# EAGLE schematic LESR_MainBoard (EAGLE 9.5.2)

## Sheet 1 of 2
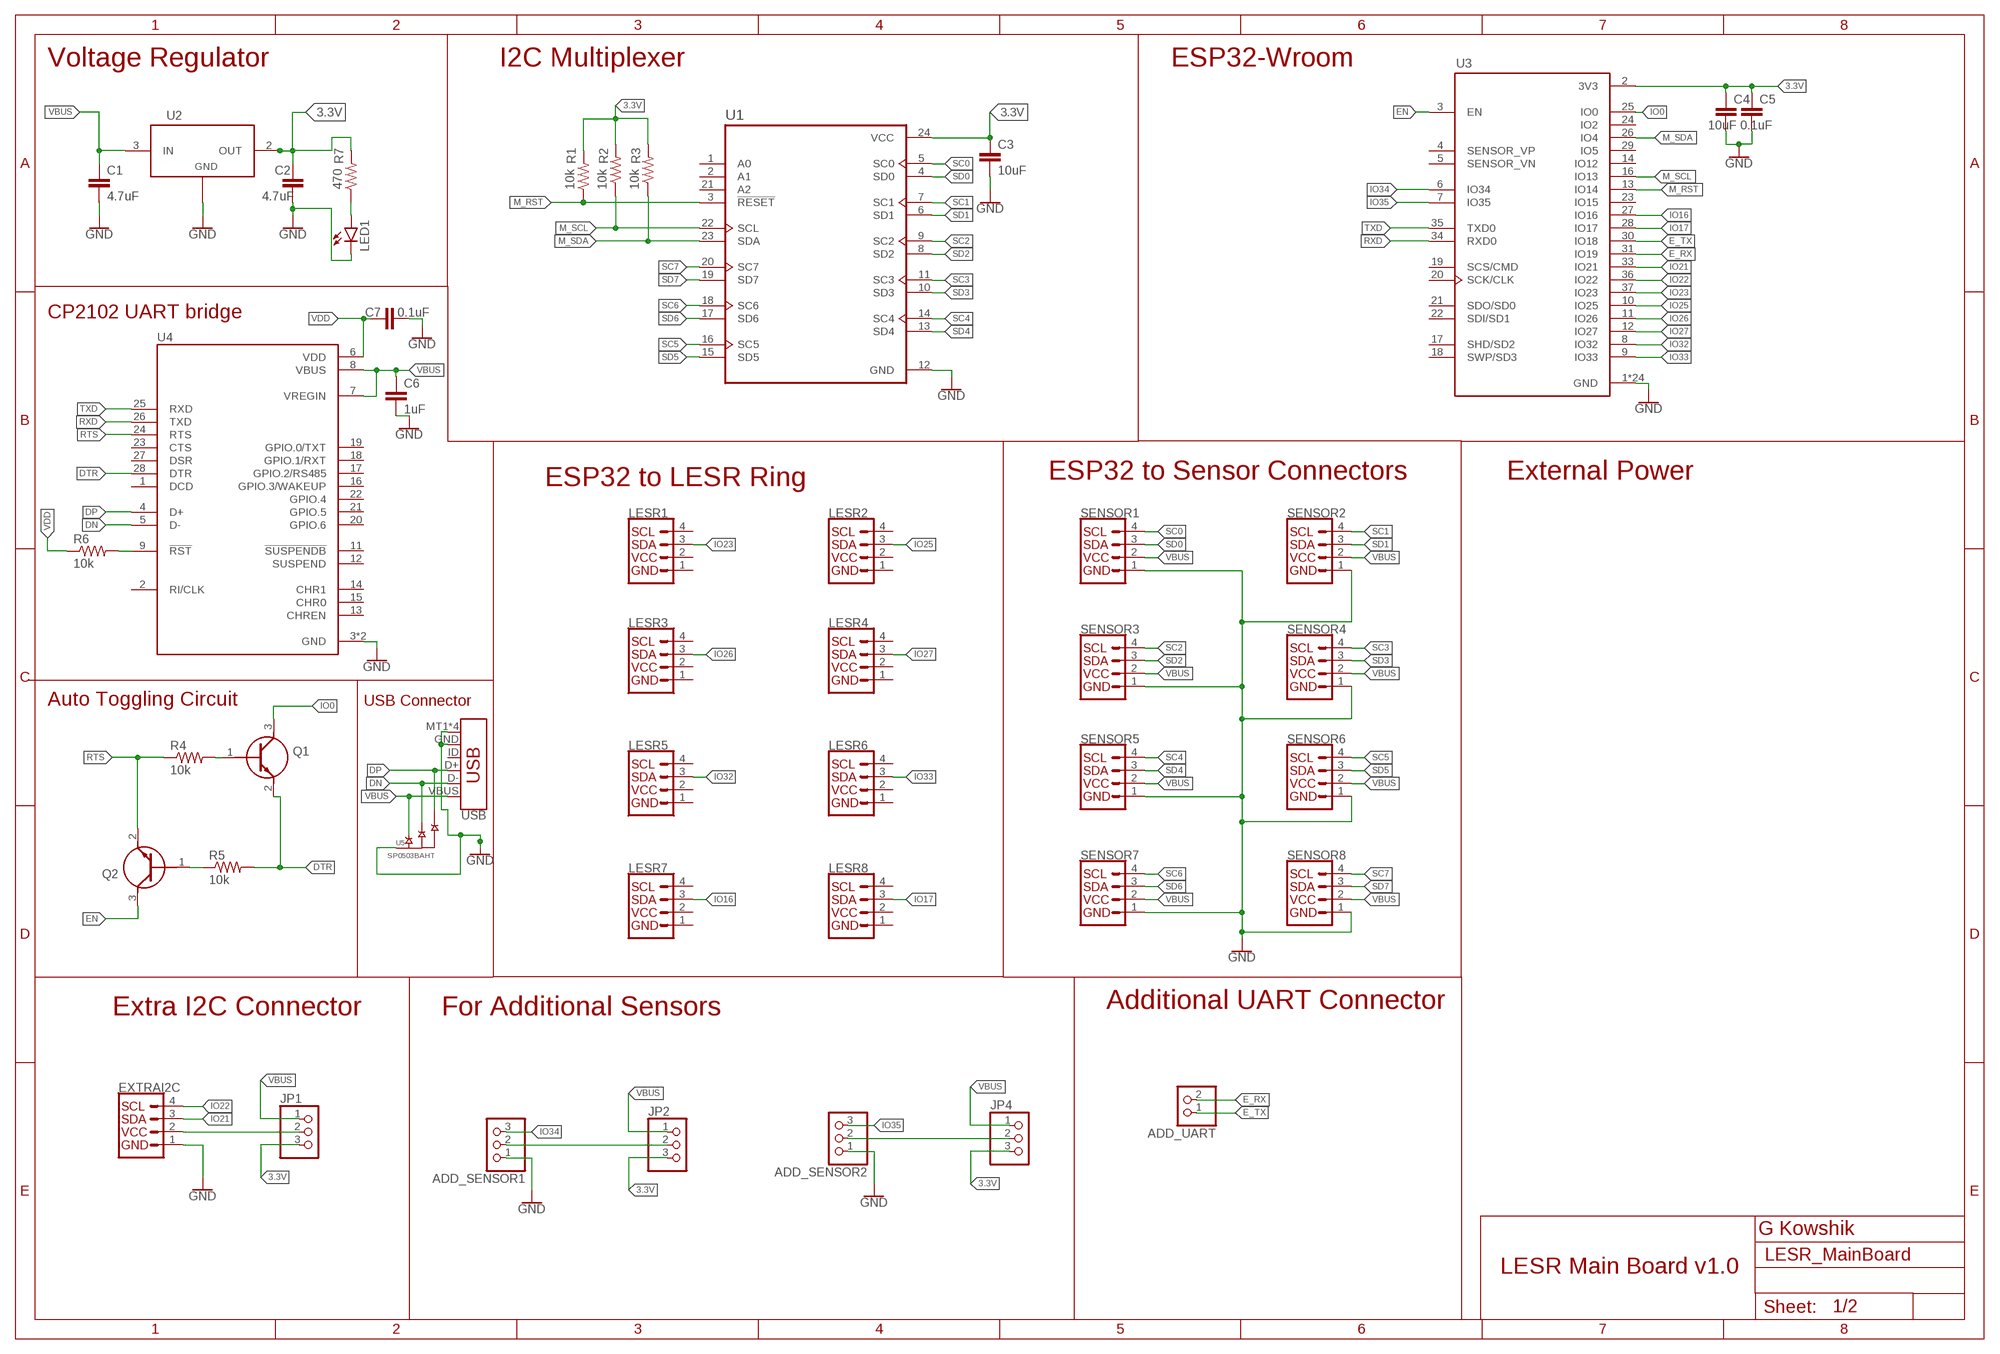
[diagram p0: schematic, sheet 1]

### Parts
ADD_SENSOR1  PINHD-1X3  [1X03]
ADD_SENSOR2  PINHD-1X3  [1X03]
ADD_UART  PINHD-1X2  [1X02]
C1  4.7uF  C-EUC0805  [C0805]
C2  4.7uF  C-EUC0805  [C0805]
C3  10uF  C-EUC0805  [C0805]
C4  10uF  C-EUC0805  [C0805]
C5  0.1uF  C-EUC0805  [C0805]
C6  1uF  C-EUC0805  [C0805]
C7  0.1uF  C-EUC0805  [C0805]
EXTRAI2C  Vertical Qwiic Connector  QWIIC_CONNECTOR  [JST04_1MM_VERT]
JP1  PINHD-1X3  [1X03]
JP2  PINHD-1X3  [1X03]
JP4  PINHD-1X3  [1X03]
LED1  LEDCHIPLED_0805  [CHIPLED_0805]
LESR1  Vertical Qwiic Connector  QWIIC_CONNECTOR  [JST04_1MM_VERT]
LESR2  Vertical Qwiic Connector  QWIIC_CONNECTOR  [JST04_1MM_VERT]
LESR3  Vertical Qwiic Connector  QWIIC_CONNECTOR  [JST04_1MM_VERT]
LESR4  Vertical Qwiic Connector  QWIIC_CONNECTOR  [JST04_1MM_VERT]
LESR5  Vertical Qwiic Connector  QWIIC_CONNECTOR  [JST04_1MM_VERT]
LESR6  Vertical Qwiic Connector  QWIIC_CONNECTOR  [JST04_1MM_VERT]
LESR7  Vertical Qwiic Connector  QWIIC_CONNECTOR  [JST04_1MM_VERT]
LESR8  Vertical Qwiic Connector  QWIIC_CONNECTOR  [JST04_1MM_VERT]
Q1  SS8050-G  [SOT95P240X115-3N]
Q2  SS8050-G  [SOT95P240X115-3N]
R1  10k  R-US_R0805  [R0805]
R2  10k  R-US_R0805  [R0805]
R3  10k  R-US_R0805  [R0805]
R4  10k  R-US_R0805  [R0805]
R5  10k  R-US_R0805  [R0805]
R6  10k  R-US_R0805  [R0805]
R7  470  R-US_R0805  [R0805]
SENSOR1  Vertical Qwiic Connector  QWIIC_CONNECTOR  [JST04_1MM_VERT]
SENSOR2  Vertical Qwiic Connector  QWIIC_CONNECTOR  [JST04_1MM_VERT]
SENSOR3  Vertical Qwiic Connector  QWIIC_CONNECTOR  [JST04_1MM_VERT]
SENSOR4  Vertical Qwiic Connector  QWIIC_CONNECTOR  [JST04_1MM_VERT]
SENSOR5  Vertical Qwiic Connector  QWIIC_CONNECTOR  [JST04_1MM_VERT]
SENSOR6  Vertical Qwiic Connector  QWIIC_CONNECTOR  [JST04_1MM_VERT]
SENSOR7  Vertical Qwiic Connector  QWIIC_CONNECTOR  [JST04_1MM_VERT]
SENSOR8  Vertical Qwiic Connector  QWIIC_CONNECTOR  [JST04_1MM_VERT]
U1  TCA9548APWR  [SOP65P640X120-24N]
U2  NCP1117ST33T3G  [SOT-223]
U3  ESP32-WROOM-32  [MODULE_ESP32-WROOM-32]
U4  CP2102N-A01-GQFN28  [QFN50P500X500X80-29N]
U5  SP0503BAHT  [SOT143]
USB  USB_MICRO-B_SMT  [USB-MICROB]

### Nets
3.3V: C2.1 C3.1 C4.1 C5.1 JP1.3 JP2.3 JP4.3 R1.2 R2.2 R3.2 R7.2 U1.24(VCC) U2.2(OUT) U2.4 U3.2(3V3)
DN: U4.5(D-) U5.3(B) USB.D-
DP: U4.4(D+) U5.4(C) USB.D+
DTR: Q1.2(E) R5.2 U4.28(DTR)
E_RX: ADD_UART.2 U3.31(IO19)
E_TX: ADD_UART.1 U3.30(IO18)
EN: Q2.3(C) U3.3(EN)
GND: ADD_SENSOR1.1 ADD_SENSOR2.1 C1.2 C2.2 C3.2 C4.2 C5.2 C6.2 C7.2 EXTRAI2C.1 LED1.C SENSOR1.1 SENSOR2.1 SENSOR3.1 SENSOR4.1 SENSOR5.1 SENSOR6.1 SENSOR7.1 SENSOR8.1 U1.12(GND) U2.1(ADJ/GND) U3.1(GND) U3.15(GND) U3.38(GND) U3.39_1(GND) U3.39_2(GND) U3.39_3(GND) U3.39_4(GND) U3.39_5(GND) U3.39_6(GND) U3.39_7(GND) U3.39_8(GND) U3.39_9(GND) U3.39_10(GND) U3.39_11(GND) U3.39_12(GND) U3.39_13(GND) U3.39_14(GND) U3.39_15(GND) U3.39_16(GND) U3.39_17(GND) U3.39_18(GND) U3.39_19(GND) U3.39_20(GND) U3.39_21(GND) U4.3(GND) U4.29(GND) U5.1(GND) USB.GND USB.MT1(SHIELD) USB.MT2(SHIELD) USB.P$1(SHIELD) USB.P$2(SHIELD)
IO0: Q1.3(C) U3.25(IO0)
IO16: LESR7.3 U3.27(IO16)
IO17: LESR8.3 U3.28(IO17)
IO21: EXTRAI2C.3 U3.33(IO21)
IO22: EXTRAI2C.4 U3.36(IO22)
IO23: LESR1.3 U3.37(IO23)
IO25: LESR2.3 U3.10(IO25)
IO26: LESR3.3 U3.11(IO26)
IO27: LESR4.3 U3.12(IO27)
IO32: LESR5.3 U3.8(IO32)
IO33: LESR6.3 U3.9(IO33)
IO34: ADD_SENSOR1.3 U3.6(IO34)
IO35: ADD_SENSOR2.3 U3.7(IO35)
M_RST: R1.1 U1.3(!RESET) U3.13(IO14)
M_SCL: R2.1 U1.22(SCL) U3.16(IO13)
M_SDA: R3.1 U1.23(SDA) U3.26(IO4)
N$1: ADD_SENSOR1.2 JP2.2
N$3: Q1.1(B) R4.2
N$4: Q2.1(B) R5.1
N$5: ADD_SENSOR2.2 JP4.2
N$6: R6.2 U4.9(!RST)
N$7: EXTRAI2C.2 JP1.2
N$8: LED1.A R7.1
RTS: Q2.2(E) R4.1 U4.24(RTS)
RXD: U3.34(RXD0) U4.26(TXD)
SC0: SENSOR1.4 U1.5(SC0)
SC1: SENSOR2.4 U1.7(SC1)
SC2: SENSOR3.4 U1.9(SC2)
SC3: SENSOR4.4 U1.11(SC3)
SC4: SENSOR5.4 U1.14(SC4)
SC5: SENSOR6.4 U1.16(SC5)
SC6: SENSOR7.4 U1.18(SC6)
SC7: SENSOR8.4 U1.20(SC7)
SD0: SENSOR1.3 U1.4(SD0)
SD1: SENSOR2.3 U1.6(SD1)
SD2: SENSOR3.3 U1.8(SD2)
SD3: SENSOR4.3 U1.10(SD3)
SD4: SENSOR5.3 U1.13(SD4)
SD5: SENSOR6.3 U1.15(SD5)
SD6: SENSOR7.3 U1.17(SD6)
SD7: SENSOR8.3 U1.19(SD7)
TXD: U3.35(TXD0) U4.25(RXD)
VBUS: C1.1 C6.1 JP1.1 JP2.1 JP4.1 SENSOR1.2 SENSOR2.2 SENSOR3.2 SENSOR4.2 SENSOR5.2 SENSOR6.2 SENSOR7.2 SENSOR8.2 U2.3(IN) U4.7(VREGIN) U4.8(VBUS) U5.2(A) USB.VBUS
VDD: C7.1 R6.1 U4.6(VDD)
Unconnected: LESR1.4 LESR2.4 LESR3.4 LESR4.4 LESR5.4 LESR6.4 LESR7.4 LESR8.4 U1.1(A0) U1.2(A1) U1.21(A2) U3.4(SENSOR_VP) U3.5(SENSOR_VN) U3.14(IO12) U3.17(SHD/SD2) U3.18(SWP/SD3) U3.19(SCS/CMD) U3.20(SCK/CLK) U3.21(SDO/SD0) U3.22(SDI/SD1) U3.23(IO15) U3.24(IO2) U3.29(IO5) U4.1(DCD) U4.2(RI/CLK) U4.11(!SUSPENDB) U4.12(SUSPEND) U4.13(CHREN) U4.14(CHR1) U4.15(CHR0) U4.16(GPIO.3/WAKEUP) U4.17(GPIO.2/RS485) U4.18(GPIO.1/RXT) U4.19(GPIO.0/TXT) U4.20(GPIO.6) U4.21(GPIO.5) U4.22(GPIO.4) U4.23(CTS) U4.27(DSR) USB.ID

### Notes on the sheet
- Voltage Regulator | I2C Multiplexer | ESP32-Wroom
- CP2102 UART bridge
- ESP32 to LESR Ring | ESP32 to Sensor Connectors | External Power
- Auto Toggling Circuit | USB Connector
- Extra I2C Connector | For Additional Sensors | Additional UART Connector
- G Kowshik
- LESR Main Board v1.0

## Sheet 2 of 2

## Power pins joined to a net without a drawn wire
1: LESR1.1 LESR2.1 LESR3.1 LESR4.1 LESR5.1 LESR6.1 LESR7.1 LESR8.1
2: LESR1.2 LESR2.2 LESR3.2 LESR4.2 LESR5.2 LESR6.2 LESR7.2 LESR8.2

## Library data of the parts
ADD_SENSOR1 ADD_SENSOR2 JP1 JP2 JP4 = adafruit:PINHD-1X3: PIN HEADER
ADD_UART = pinhead:PINHD-1X2: PIN HEADER
C1-C7 = rcl:C-EU: CAPACITOR, European symbol; SPICEPREFIX: C
EXTRAI2C LESR1-LESR8 SENSOR1-SENSOR8 = SparkFun-Connectors:QWIIC_CONNECTOR: SparkFun I2C Standard Qwiic Connector An SMD 1mm pitch JST connector makes it easy and quick (get it? Qwiic?) to connect I2C devices to each other. The Qwiic system <http://www.sparkfun.com/qwiic> enables fast and solderless connection between popular platforms and various sensors and actuators. We carry 200mm <https://www.sparkfun.com/products/14204>, 100mm <https://www.sparkfun.com/products/14205>, 50mm <https://www.sparkfun.com/products/14206>, and breadboard friendly <https://www.sparkfun.com/products/14207> Qwiic cables. We also offer 10 pcs strips <https://www.sparkfun.com/products/14323> the SMD connectors.; PROD_ID: CONN-14483
LED1 = led:LED: LED OSRAM: - CHIPLED LG R971, LG N971, LY N971, LG Q971, LY Q971, LO R971, LY R971 LH N974, LH R974 LS Q976, LO Q976, LY Q976 LO Q996 - Hyper CHIPLED LW Q18S LB Q993, LB Q99A, LB R99A - SideLED LS A670, LO A670, LY A670, LG A670, LP A670 LB A673, LV A673, LT A673, LW A673 LH A674 LY A675 LS A676, LA A676, LO A676, LY A676, LW A676 LS A679, LY A679, LG A679 - Hyper Micro SIDELED® LS Y876, LA Y876, LO Y876, LY Y876 LT Y87S - SmartLED LW L88C, LW L88S LB L89C, LB L89S, LG L890 LS L89K, LO L89K, LY L89K LS L896, LA L896, LO L896, LY L896 - TOPLED LS T670, LO T670, LY T670, LG T670, LP T670 LSG T670, LSP T670, LSY T670, LOP T670, LYG T670 LG T671, LOG T671, LSG T671 LB T673, LV T673, LT T673, LW T673 LH T674 LS T676, LA T676, LO T676, LY T676, LB T676, LH T676, LSB T676, LW T676 LB T67C, LV T67C, LT T67C, LS T67K, LO T67K, LY T67K, LW E67C LS E67B, LA E67B, LO E67B, LY E67B, LB E67C, LV E67C, LT E67C LW T67C LS T679, LY T679, LG T679 LS T770, LO T770, LY T770, LG T770, LP T770 LB T773, LV T773, LT T773, LW T773 LH T774 LS E675, LA E675, LY E675, LS T675 LS T776, LA T776, LO T776, LY T776, LB T776 LHGB T686 LT T68C, LB T68C - Hyper Mini TOPLED® LB M676 - Mini TOPLED Santana® LG M470 LS M47K, LO M47K, LY M47K Source: http://www.osram.convergy.de LUXEON: - LUMILED® LXK2-PW12-R00, LXK2-PW12-S00, LXK2-PW14-U00, LXK2-PW14-V00 LXK2-PM12-R00, LXK2-PM12-S00, LXK2-PM14-U00 LXK2-PE12-Q00, LXK2-PE12-R00, LXK2-PE12-S00, LXK2-PE14-T00, LXK2-PE14-U00 LXK2-PB12-K00, LXK2-PB12-L00, LXK2-PB12-M00, LXK2-PB14-N00, LXK2-PB14-P00, LXK2-PB14-Q00 LXK2-PR12-L00, LXK2-PR12-M00, LXK2-PR14-Q00, LXK2-PR14-R00 LXK2-PD12-Q00, LXK2-PD12-R00, LXK2-PD12-S00 LXK2-PH12-R00, LXK2-PH12-S00 LXK2-PL12-P00, LXK2-PL12-Q00, LXK2-PL12-R00 Source: www.luxeon.com KINGBRIGHT: KA-3528ASYC Source: www.kingbright.com
Q1 Q2 = SS8050-G_NPN_transistor:SS8050-G: Bipolar Transistors - BJT NPN TRANSISTOR 1.5A 40V Source: Datasheet <http://www.comchiptech.com/admin/files/product/SS8050-G RevA181526.pdf>; AVAILABILITY: Unavailable; DESCRIPTION: Bipolar _BJT_ Transistor NPN 25V 1.5A 100MHz 300mW Surface Mount SOT-23; MF: Comchip Technology; MP: SS8050-G; PACKAGE: TO-236 Comchip; PRICE: None
R1-R7 = rcl:R-US_: RESISTOR, American symbol; SPICEPREFIX: R
U1 = TCA9548APWR_I2CMultiplexer:TCA9548APWR: Low-Voltage 8-Channel I2C Switch With Reset 24-TSSOP -40 to 85; AVAILABILITY: Unavailable; DESCRIPTION: IC I2C SW 8CH W/RESET 24TSSOP; DIGIKEY-PURCHASE-URL: https://snapeda.com/shop?store=DigiKey&id=280817; MF: Texas Instruments; MP: TCA9548APWR; PACKAGE: TSSOP-24 Texas Instruments; PRICE: None
U2 = IC:NCP1117ST33T3G: IC REG LINEAR 3.3V 1A SOT223 Manufacturer's datasheet <https://www.onsemi.com/pub/Collateral/NCP1117-D.PDF>; CREATED_BY: PCBLayout.com; DIGIKEY_PART_NUMBER: NCP1117ST33T3GOSTR-ND; MANUFACTURER: ON Semiconductor; MPN: NCP1117ST33T3G; PACKAGE: SOT-223
U3 = ESP32-WROOM-32:ESP32-WROOM-32: Bluetooth, WiFi Transceiver Module 2.4GHz ~ 2.5GHz Surface Mount; AVAILABILITY: Unavailable; DESCRIPTION: Bluetooth, WiFi 802.11b/g/n, Bluetooth v4.2 + EDR, Class 1, 2 and 3 Transceiver Module 2.4GHz ~ 2.5GHz Integrated, Trace Surface Mount; MF: Espressif Systems; MP: ESP32-WROOM-32; PACKAGE: Module Espressif Systems; PRICE: None
U4 = CP2102N-A01-GQFN28:CP2102N-A01-GQFN28: Ic Bridge Usb To Uart 28qfn; AVAILABILITY: Unavailable; DESCRIPTION: USB Bridge, USB to UART USB 2.0 UART Interface 28-QFN (5x5); MF: Silicon Labs; MP: CP2102N-A01-GQFN28; PACKAGE: QFN-28 Silicon Labs; PRICE: None
U5 = ESD_SP0503BAHT:SP0503BAHT; AVAILABILITY: Unavailable; DESCRIPTION: 8.5V Clamp Ipp Tvs Diode Surface Mount SOT-143-4; MF: Littelfuse Inc.; MP: SP0503BAHT; PACKAGE: SOT-143 Littelfuse; PRICE: None
USB = SparkFun-Connectors:USB_MICRO-B: USB Type Micro-B Connector Male/female and PTH/SMT variants SparkFun Products: SparkFun microB USB Breakout <https://www.sparkfun.com/products/12035> SparkFun USB microB Plug Breakout <https://www.sparkfun.com/products/10031> SparkFun ESP8266 Thing <https://www.sparkfun.com/products/13231>; PROD_ID: CONN-09505; SF_ID: PRT-08533